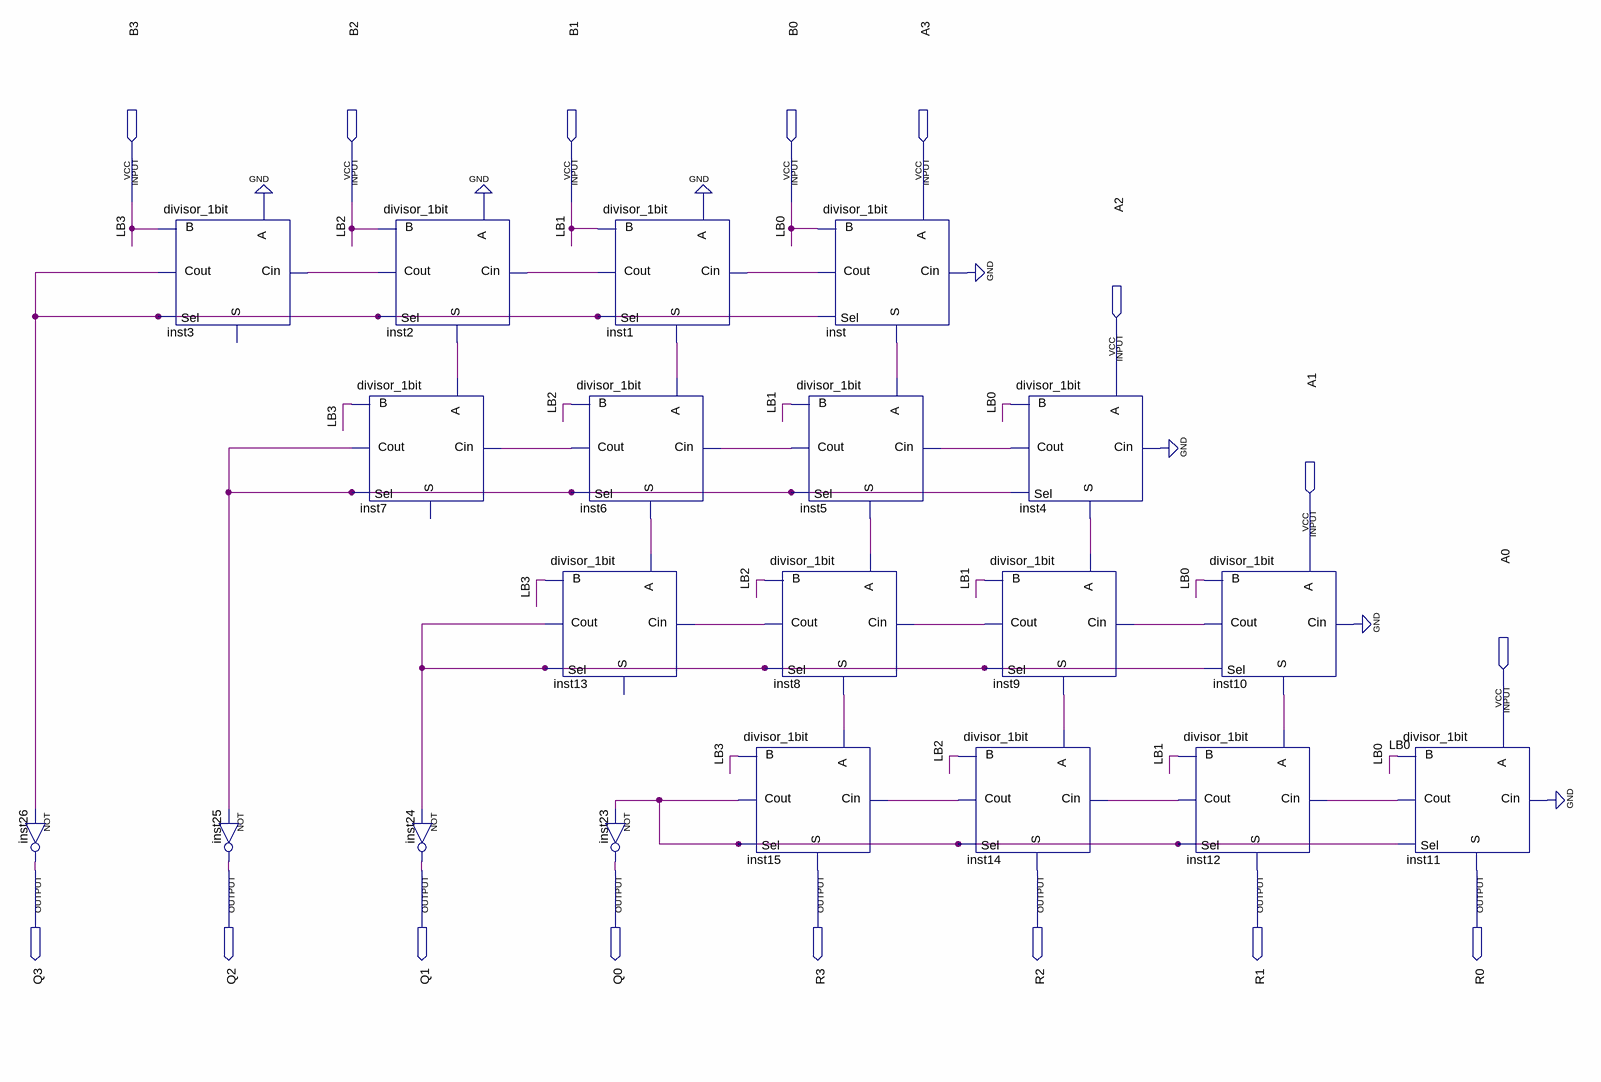
[diagram p0: schematic sheet]
// Quartus schematic divisor_8bit.bdf as structural Verilog: 20 symbols, 16 pins
module divisor_8bit (
  input  B3,
  input  B2,
  input  B1,
  input  B0,
  input  A3,
  input  A2,
  input  A1,
  input  A0,
  output Q3,
  output Q2,
  output Q1,
  output Q0,
  output R3,
  output R2,
  output R1,
  output R0
);

  wire inst1_cout, inst1_s, inst2_cout, inst2_s, inst3_cout, inst4_cout, inst4_s, inst5_cout, inst5_s,
       inst6_cout, inst6_s, inst7_cout, inst8_cout, inst8_s, inst9_cout, inst9_s, inst10_cout, inst10_s,
       inst11_cout, inst12_cout, inst13_cout, inst14_cout, inst15_cout, inst_cout, inst_s;

  not inst26 (Q3, inst3_cout);
  divisor_1bit inst3 (.A(1'b0), .B(B3), .Cin(inst2_cout), .Sel(inst3_cout), .Cout(inst3_cout));  // open: S
  not inst25 (Q2, inst7_cout);
  divisor_1bit inst2 (.A(1'b0), .B(B2), .Cin(inst1_cout), .Sel(inst3_cout), .S(inst2_s), .Cout(inst2_cout));
  divisor_1bit inst7 (.A(inst2_s), .B(B3), .Cin(inst6_cout), .Sel(inst7_cout), .Cout(inst7_cout));  // open: S
  not inst24 (Q1, inst13_cout);
  divisor_1bit inst13 (.A(inst6_s), .B(B3), .Cin(inst8_cout), .Sel(inst13_cout), .Cout(inst13_cout));  // open: S
  divisor_1bit inst1 (.A(1'b0), .B(B1), .Cin(inst_cout), .Sel(inst3_cout), .S(inst1_s), .Cout(inst1_cout));
  divisor_1bit inst6 (.A(inst1_s), .B(B2), .Cin(inst5_cout), .Sel(inst7_cout), .S(inst6_s), .Cout(inst6_cout));
  not inst23 (Q0, inst15_cout);
  divisor_1bit inst8 (.A(inst5_s), .B(B2), .Cin(inst9_cout), .Sel(inst13_cout), .S(inst8_s), .Cout(inst8_cout));
  divisor_1bit inst15 (.A(inst8_s), .B(B3), .Cin(inst14_cout), .Sel(inst15_cout), .S(R3), .Cout(inst15_cout));
  divisor_1bit inst (.A(A3), .B(B0), .Cin(1'b0), .Sel(inst3_cout), .S(inst_s), .Cout(inst_cout));
  divisor_1bit inst5 (.A(inst_s), .B(B1), .Cin(inst4_cout), .Sel(inst7_cout), .S(inst5_s), .Cout(inst5_cout));
  divisor_1bit inst14 (.A(inst9_s), .B(B2), .Cin(inst12_cout), .Sel(inst15_cout), .S(R2), .Cout(inst14_cout));
  divisor_1bit inst4 (.A(A2), .B(B0), .Cin(1'b0), .Sel(inst7_cout), .S(inst4_s), .Cout(inst4_cout));
  divisor_1bit inst9 (.A(inst4_s), .B(B1), .Cin(inst10_cout), .Sel(inst13_cout), .S(inst9_s), .Cout(inst9_cout));
  divisor_1bit inst12 (.A(inst10_s), .B(B1), .Cin(inst11_cout), .Sel(inst15_cout), .S(R1), .Cout(inst12_cout));
  divisor_1bit inst10 (.A(A1), .B(B0), .Cin(1'b0), .Sel(inst13_cout), .S(inst10_s), .Cout(inst10_cout));
  divisor_1bit inst11 (.A(A0), .B(B0), .Cin(1'b0), .Sel(inst15_cout), .S(R0), .Cout(inst11_cout));

  // Other names for the same wires on the sheet: LB0 = B0; LB1 = B1; LB2 = B2; LB3 = B3
endmodule
